# EAGLE design B210B (EAGLE 6.6.0)
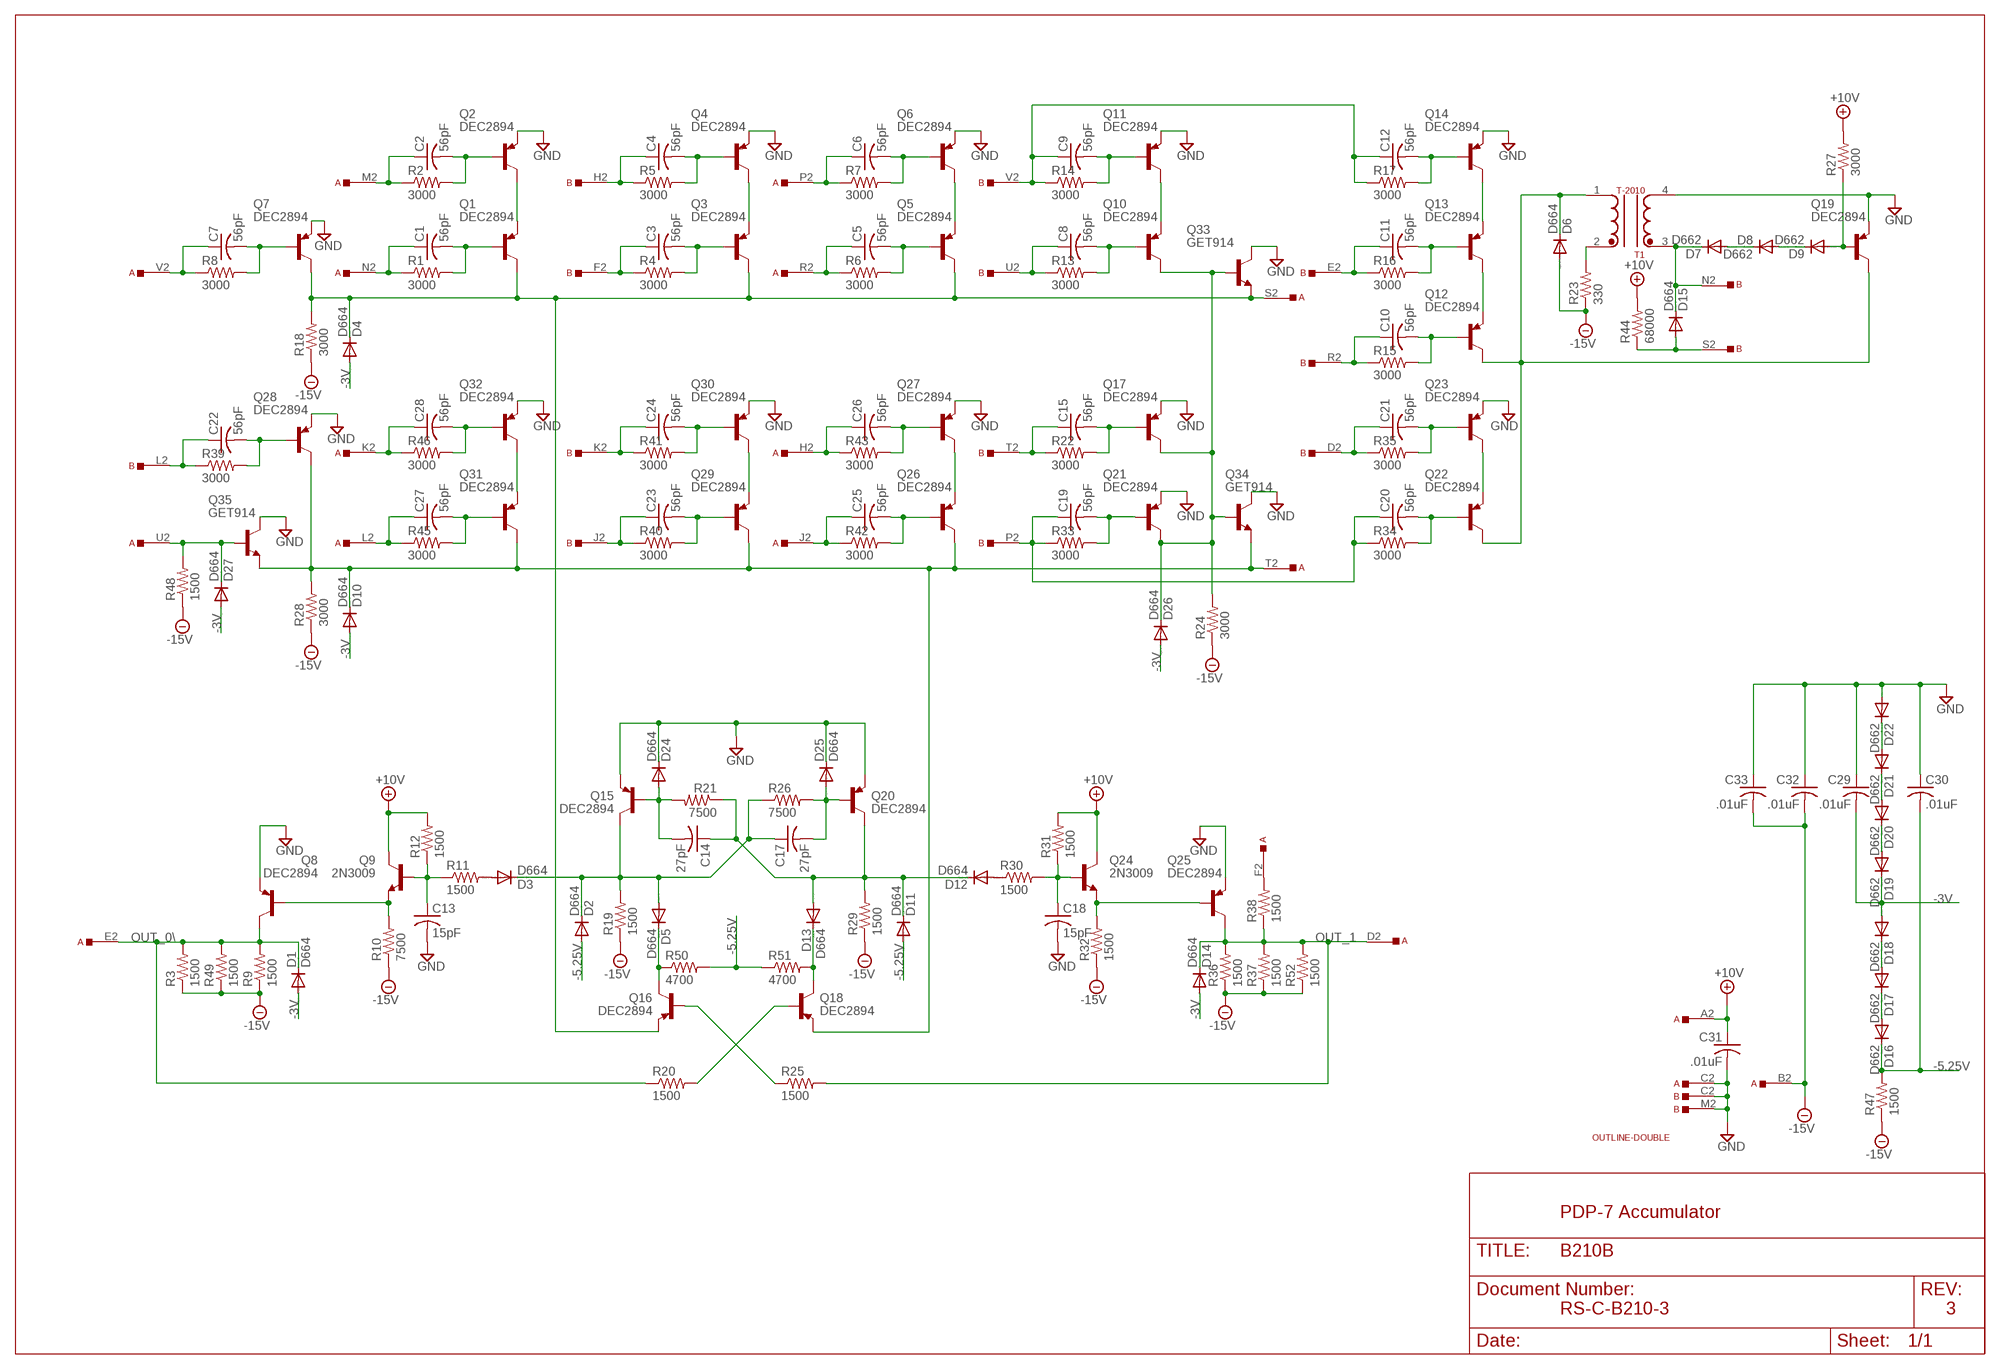
[diagram p0: schematic, sheet 1]

## Parts
A  SS-TOP  [EDGE-CON1]
B  SS-TOP  [EDGE-CON1]
C1  56pF  C-US  [C063-025X075]
C2  56pF  C-US  [C063-025X075]
C3  56pF  C-US  [C063-025X075]
C4  56pF  C-US  [C063-025X075]
C5  56pF  C-US  [C063-025X075]
C6  56pF  C-US  [C063-025X075]
C7  56pF  C-US  [C063-025X075]
C8  56pF  C-US  [C063-025X075]
C9  56pF  C-US  [C063-025X075]
C10  56pF  C-US  [C063-025X075]
C11  56pF  C-US  [C063-025X075]
C12  56pF  C-US  [C063-025X075]
C13  15pF  C-US  [C063-025X075]
C14  27pF  C-US  [C063-025X075]
C15  56pF  C-US  [C063-025X075]
C17  27pF  C-US  [C063-025X075]
C18  15pF  C-US  [C063-025X075]
C19  56pF  C-US  [C063-025X075]
C20  56pF  C-US  [C063-025X075]
C21  56pF  C-US  [C063-025X075]
C22  56pF  C-US  [C063-025X075]
C23  56pF  C-US  [C063-025X075]
C24  56pF  C-US  [C063-025X075]
C25  56pF  C-US  [C063-025X075]
C26  56pF  C-US  [C063-025X075]
C27  56pF  C-US  [C063-025X075]
C28  56pF  C-US  [C063-025X075]
C29  .01uF  C-US  [C063-025X075]
C30  .01uF  C-US  [C063-025X075]
C31  .01uF  C-US  [C063-025X075]
C32  .01uF  C-US  [C063-025X075]
C33  .01uF  C-US  [C063-025X075]
D1  D664  DIODE-DO35-10  [DO35-10]
D2  D664  DIODE-DO35-10  [DO35-10]
D3  D664  DIODE-DO35-10  [DO35-10]
D4  D664  DIODE-DO35-10  [DO35-10]
D5  D664  DIODE-DO35-10  [DO35-10]
D6  D664  DIODE-DO35-10  [DO35-10]
D7  D662  DIODE-DO35-10  [DO35-10]
D8  D662  DIODE-DO35-10  [DO35-10]
D9  D662  DIODE-DO35-10  [DO35-10]
D10  D664  DIODE-DO35-10  [DO35-10]
D11  D664  DIODE-DO35-10  [DO35-10]
D12  D664  DIODE-DO35-10  [DO35-10]
D13  D664  DIODE-DO35-10  [DO35-10]
D14  D664  DIODE-DO35-10  [DO35-10]
D15  D664  DIODE-DO35-10  [DO35-10]
D16  D662  DIODE-DO35-10  [DO35-10]
D17  D662  DIODE-DO35-10  [DO35-10]
D18  D662  DIODE-DO35-10  [DO35-10]
D19  D662  DIODE-DO35-10  [DO35-10]
D20  D662  DIODE-DO35-10  [DO35-10]
D21  D662  DIODE-DO35-10  [DO35-10]
D22  D662  DIODE-DO35-10  [DO35-10]
D24  D664  DIODE-DO35-10  [DO35-10]
D25  D664  DIODE-DO35-10  [DO35-10]
D26  D664  DIODE-DO35-10  [DO35-10]
D27  D664  DIODE-DO35-10  [DO35-10]
Q1  DEC2894  -PNP-TO5  [TO5]
Q2  DEC2894  -PNP-TO5  [TO5]
Q3  DEC2894  -PNP-TO5  [TO5]
Q4  DEC2894  -PNP-TO5  [TO5]
Q5  DEC2894  -PNP-TO5  [TO5]
Q6  DEC2894  -PNP-TO5  [TO5]
Q7  DEC2894  -PNP-TO5  [TO5]
Q8  DEC2894  -PNP-TO5  [TO5]
Q9  2N3009  -NPN-TO5  [TO5]
Q10  DEC2894  -PNP-TO5  [TO5]
Q11  DEC2894  -PNP-TO5  [TO5]
Q12  DEC2894  -PNP-TO5  [TO5]
Q13  DEC2894  -PNP-TO5  [TO5]
Q14  DEC2894  -PNP-TO5  [TO5]
Q15  DEC2894  -PNP-TO5  [TO5]
Q16  DEC2894  -PNP-TO5  [TO5]
Q17  DEC2894  -PNP-TO5  [TO5]
Q18  DEC2894  -PNP-TO5  [TO5]
Q19  DEC2894  -PNP-TO5  [TO5]
Q20  DEC2894  -PNP-TO5  [TO5]
Q21  DEC2894  -PNP-TO5  [TO5]
Q22  DEC2894  -PNP-TO5  [TO5]
Q23  DEC2894  -PNP-TO5  [TO5]
Q24  2N3009  -NPN-TO5  [TO5]
Q25  DEC2894  -PNP-TO5  [TO5]
Q26  DEC2894  -PNP-TO5  [TO5]
Q27  DEC2894  -PNP-TO5  [TO5]
Q28  DEC2894  -PNP-TO5  [TO5]
Q29  DEC2894  -PNP-TO5  [TO5]
Q30  DEC2894  -PNP-TO5  [TO5]
Q31  DEC2894  -PNP-TO5  [TO5]
Q32  DEC2894  -PNP-TO5  [TO5]
Q33  GET914  -NPN-TO5  [TO5]
Q34  GET914  -NPN-TO5  [TO5]
Q35  GET914  -NPN-TO5  [TO5]
R1  3000  R-US_0207/10  [0207/10]
R2  3000  R-US_0207/10  [0207/10]
R3  1500  R-US_0207/10  [0207/10]
R4  3000  R-US_0207/10  [0207/10]
R5  3000  R-US_0207/10  [0207/10]
R6  3000  R-US_0207/10  [0207/10]
R7  3000  R-US_0207/10  [0207/10]
R8  3000  R-US_0207/10  [0207/10]
R9  1500  R-US_0207/10  [0207/10]
R10  7500  R-US_0207/10  [0207/10]
R11  1500  R-US_0207/10  [0207/10]
R12  1500  R-US_0207/10  [0207/10]
R13  3000  R-US_0207/10  [0207/10]
R14  3000  R-US_0207/10  [0207/10]
R15  3000  R-US_0207/10  [0207/10]
R16  3000  R-US_0207/10  [0207/10]
R17  3000  R-US_0207/10  [0207/10]
R18  3000  R-US_0207/10  [0207/10]
R19  1500  R-US_0207/10  [0207/10]
R20  1500  R-US_0207/10  [0207/10]
R21  7500  R-US_0207/10  [0207/10]
R22  3000  R-US_0207/10  [0207/10]
R23  330  R-US_0207/10  [0207/10]
R24  3000  R-US_0207/10  [0207/10]
R25  1500  R-US_0207/10  [0207/10]
R26  7500  R-US_0207/10  [0207/10]
R27  3000  R-US_0207/10  [0207/10]
R28  3000  R-US_0207/10  [0207/10]
R29  1500  R-US_0207/10  [0207/10]
R30  1500  R-US_0207/10  [0207/10]
R31  1500  R-US_0207/10  [0207/10]
R32  1500  R-US_0207/10  [0207/10]
R33  3000  R-US_0207/10  [0207/10]
R34  3000  R-US_0207/10  [0207/10]
R35  3000  R-US_0207/10  [0207/10]
R36  1500  R-US_0207/10  [0207/10]
R37  1500  R-US_0207/10  [0207/10]
R38  1500  R-US_0207/10  [0207/10]
R39  3000  R-US_0207/10  [0207/10]
R40  3000  R-US_0207/10  [0207/10]
R41  3000  R-US_0207/10  [0207/10]
R42  3000  R-US_0207/10  [0207/10]
R43  3000  R-US_0207/10  [0207/10]
R44  68000  R-US_0207/10  [0207/10]
R45  3000  R-US_0207/10  [0207/10]
R46  3000  R-US_0207/10  [0207/10]
R47  1500  R-US_0207/10  [0207/10]
R48  1500  R-US_0207/10  [0207/10]
R49  1500  R-US_0207/10  [0207/10]
R50  4700  R-US_0207/10  [0207/10]
R51  4700  R-US_0207/10  [0207/10]
R52  1500  R-US_0207/10  [0207/10]
T1  T-2010  [TRANSFORMER2]
U$1  OUTLINE-DOUBLE  [DOUBLE]

## Nets
+10V: A.A2 C31.1 Q9.3(C) Q24.3(C) R12.2 R27.2 R31.2 R44.2
-3V: C29.2 D1.A D4.A D10.A D14.A D18.A D19.C D26.A D27.A
-5.25V: C30.2 D2.A D11.A D16.C R47.2 R50.2 R51.1
-15V: A.B2 C32.2 C33.2 D6.A R3.1 R9.1 R10.1 R18.1 R19.1 R23.1 R24.1 R28.1 R29.1 R32.1 R36.1 R37.1 R47.1 R48.1 R49.1 R52.1
GND: A.C2 B.C2 B.M2 C13.2 C18.2 C29.1 C30.1 C31.2 C32.1 C33.1 D22.A D24.C D25.C Q2.1(E) Q4.1(E) Q6.1(E) Q7.1(E) Q8.1(E) Q11.1(E) Q14.1(E) Q15.1(E) Q17.1(E) Q19.1(E) Q20.1(E) Q21.1(E) Q23.1(E) Q25.1(E) Q27.1(E) Q28.1(E) Q30.1(E) Q32.1(E) Q33.3(C) Q34.3(C) Q35.3(C) T1.4
N$1: A.N2 C1.1 R1.1
N$2: C1.2 Q1.2(B) R1.2
N$3: A.M2 C2.1 R2.1
N$4: C2.2 Q2.2(B) R2.2
N$5: B.F2 C3.1 R4.1
N$6: C3.2 Q3.2(B) R4.2
N$7: B.H2 C4.1 R5.1
N$8: C4.2 Q4.2(B) R5.2
N$9: A.R2 C5.1 R6.1
N$10: C5.2 Q5.2(B) R6.2
N$11: A.P2 C6.1 R7.1
N$12: C6.2 Q6.2(B) R7.2
N$13: A.V2 C7.1 R8.1
N$14: C7.2 Q7.2(B) R8.2
N$15: D6.C Q12.3(C) Q19.3(C) Q22.3(C) T1.1
N$16: R23.2 T1.2
N$17: Q10.1(E) Q11.3(C)
N$18: D26.C Q10.3(C) Q17.3(C) Q21.3(C) Q33.2(B) Q34.2(B) R24.2
N$19: B.U2 C8.1 R13.1
N$20: C8.2 Q10.2(B) R13.2
N$21: B.V2 C9.1 C12.1 R14.1 R17.1
N$22: C9.2 Q11.2(B) R14.2
N$23: B.R2 C10.1 R15.1
N$24: C10.2 Q12.2(B) R15.2
N$25: B.E2 C11.1 R16.1
N$26: C11.2 Q13.2(B) R16.2
N$27: B.N2 D7.C D15.C T1.3
N$28: C12.2 Q14.2(B) R17.2
N$29: B.T2 C15.1 R22.1
N$30: C15.2 Q17.2(B) R22.2
N$31: C17.1 D2.C D3.C D5.A Q15.3(C) R19.2 R26.1
N$32: C17.2 D25.A Q20.2(B) R26.2
N$33: Q16.2(B) R25.1
N$34: Q18.2(B) R20.2
N$35: C14.1 D11.C D12.C D13.A Q20.3(C) R21.1 R29.2
N$36: C14.2 D24.A Q15.2(B) R21.2
N$37: B.P2 C19.1 C20.1 R33.1 R34.1
N$38: C19.2 Q21.2(B) R33.2
N$39: D7.A D8.C
N$40: D8.A D9.C
N$41: D9.A Q19.2(B) R27.1
N$42: D21.A D22.C
N$43: B.L2 C22.1 R39.1
N$44: C22.2 Q28.2(B) R39.2
N$45: A.T2 D10.C Q18.1(E) Q26.3(C) Q28.3(C) Q29.3(C) Q31.3(C) Q34.1(E) Q35.1(E) R28.2
N$46: D5.C Q16.3(C) R50.1
N$47: B.S2 D15.A R44.1
N$48: C25.2 Q26.2(B) R42.2
N$49: Q1.1(E) Q2.3(C)
N$50: A.S2 D4.C Q1.3(C) Q3.3(C) Q5.3(C) Q7.3(C) Q16.1(E) Q33.1(E) R18.2
N$51: Q5.1(E) Q6.3(C)
N$52: Q3.1(E) Q4.3(C)
N$53: Q12.1(E) Q13.3(C)
N$54: Q13.1(E) Q14.3(C)
N$55: A.L2 C27.1 R45.1
N$56: C27.2 Q31.2(B) R45.2
N$57: A.K2 C28.1 R46.1
N$58: C28.2 Q32.2(B) R46.2
N$59: C20.2 Q22.2(B) R34.2
N$60: Q31.1(E) Q32.3(C)
N$61: A.H2 C26.1 R43.1
N$62: C26.2 Q27.2(B) R43.2
N$63: C23.2 Q29.2(B) R40.2
N$64: Q26.1(E) Q27.3(C)
N$65: A.J2 C25.1 R42.1
N$66: B.K2 C24.1 R41.1
N$67: C24.2 Q30.2(B) R41.2
N$68: B.D2 C21.1 R35.1
N$69: Q29.1(E) Q30.3(C)
N$70: B.J2 C23.1 R40.1
N$71: C21.2 Q23.2(B) R35.2
N$72: Q22.1(E) Q23.3(C)
N$73: D20.A D21.C
N$74: D19.A D20.C
N$75: D16.A D17.C
N$76: D17.A D18.C
N$77: D13.C Q18.3(C) R51.2
N$78: D3.A R11.2
N$79: C13.1 Q9.2(B) R11.1 R12.1
N$80: C18.1 Q24.2(B) R30.2 R31.1
N$81: D12.A R30.1
N$82: Q8.2(B) Q9.1(E) R10.2
N$83: Q24.1(E) Q25.2(B) R32.2
N$84: A.F2 R38.2
N$85: A.U2 D27.C Q35.2(B) R48.2
OUT_0\: A.E2 D1.C Q8.3(C) R3.2 R9.2 R20.1 R49.2
OUT_1: A.D2 D14.C Q25.3(C) R25.2 R36.2 R37.2 R38.1 R52.2
Unconnected: B.A2 B.B2

## Notes on the sheet
- PDP-7 Accumulator
- RS-C-B210-3 | 3

## Library data of the parts
A B = dec-con:SS-TOP: Single Sided Top Connector. Also suitable for building wider single-sided modules.
C1-C15 C17-C33 = dec-con:C-US: Capacitors with funky DEC lead spacing.
D1-D22 D24-D27 = diode:DIODE-: DIODE
Q1-Q8 Q10-Q23 Q25-Q32 = transistor:*-PNP-: PNP Transistror
Q9 Q24 Q33-Q35 = transistor:*-NPN-: NPN Transistror BF959 corrected 2008.03.06
R1-R52 = rcl:R-US_: RESISTOR, American symbol
T1 = dec-con:T-2010: Button Transformer
U$1 = dec-con:OUTLINE-*: Board outlines for DEC boards.

## Board
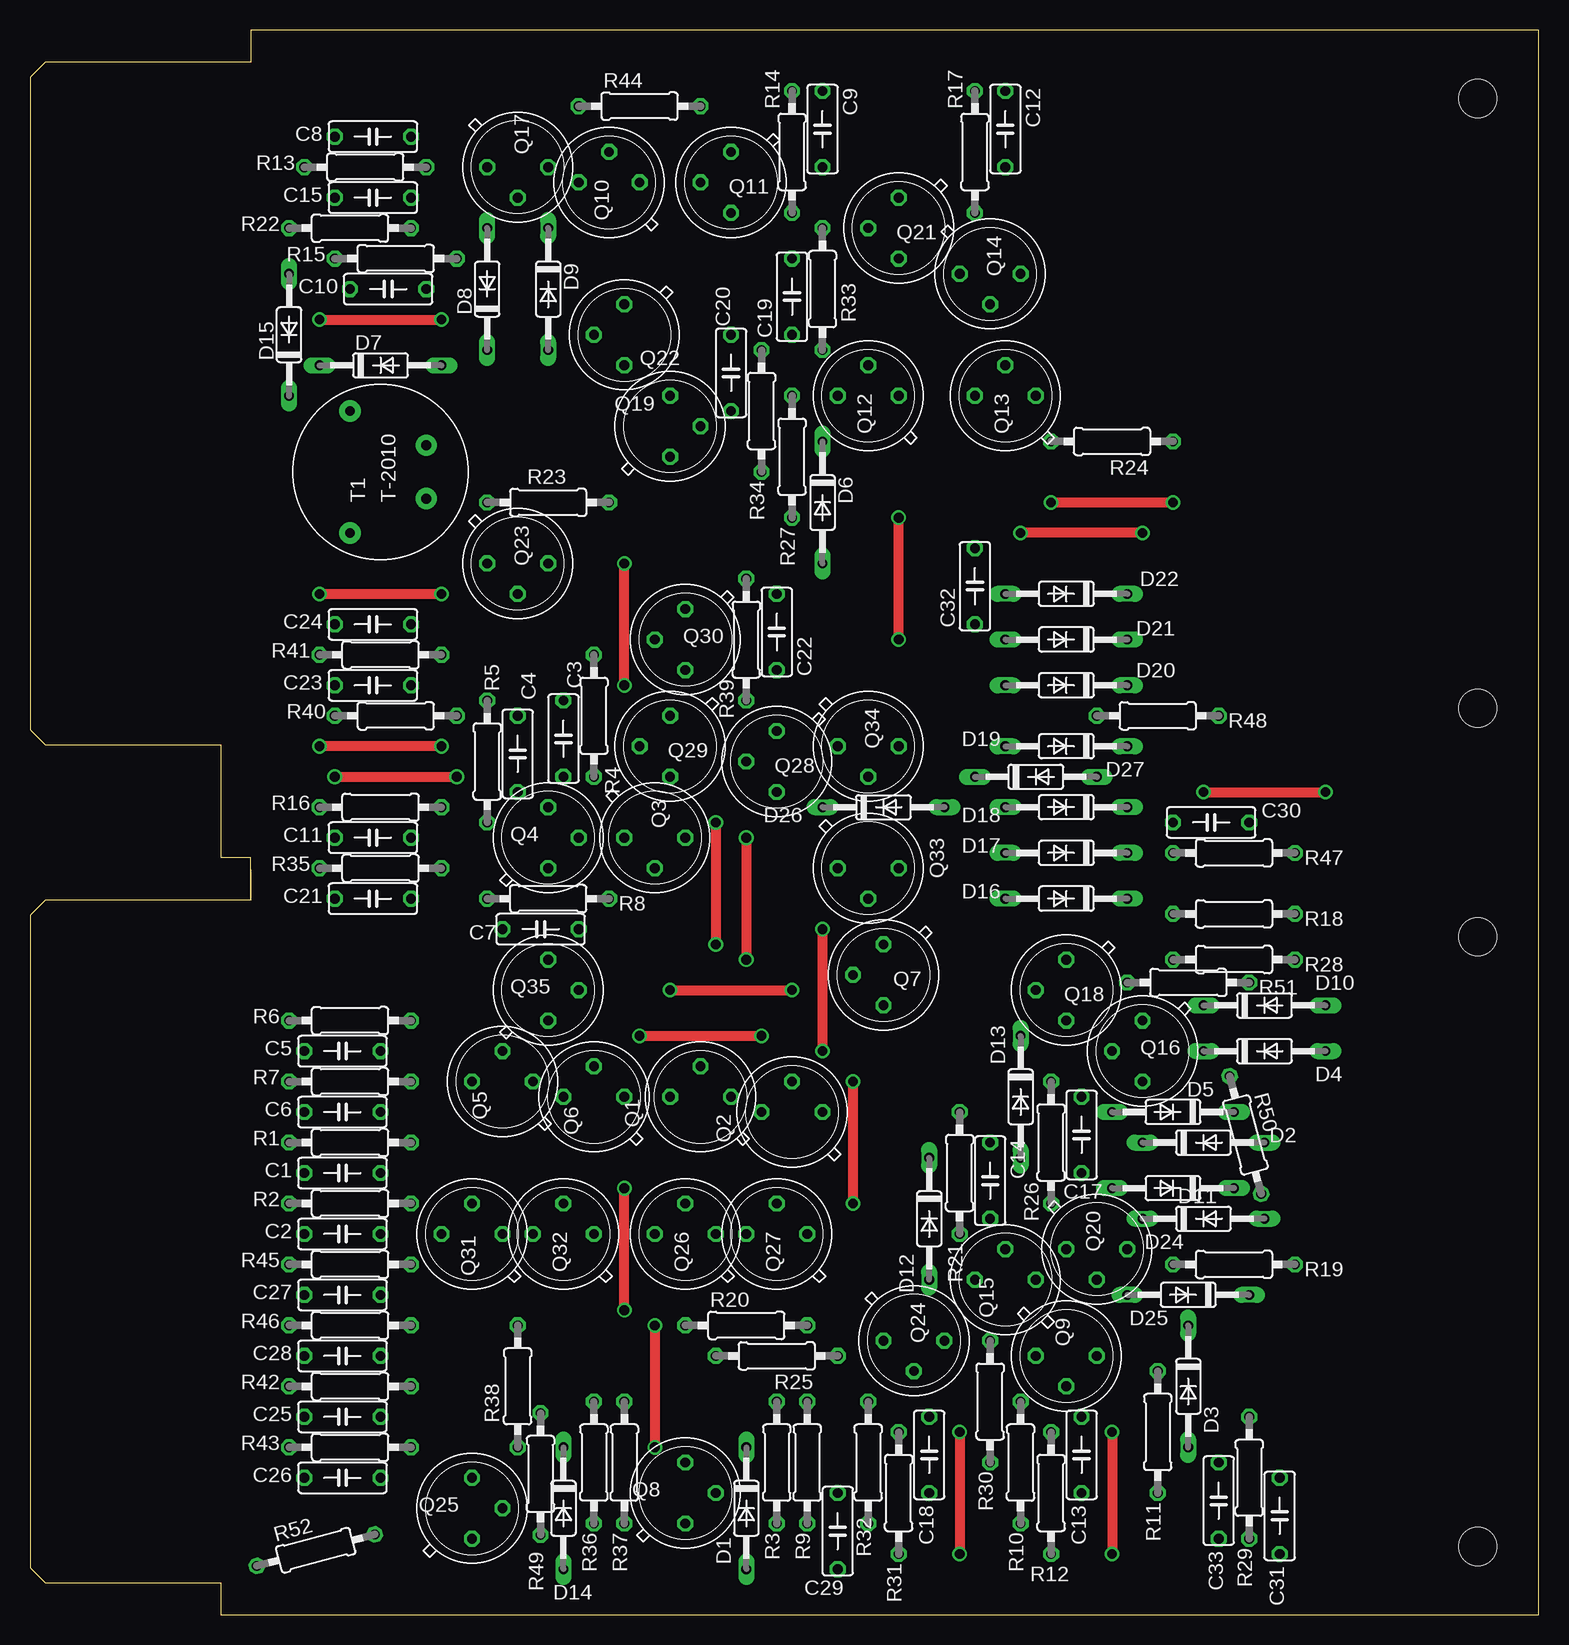
[diagram p1: board, top side]
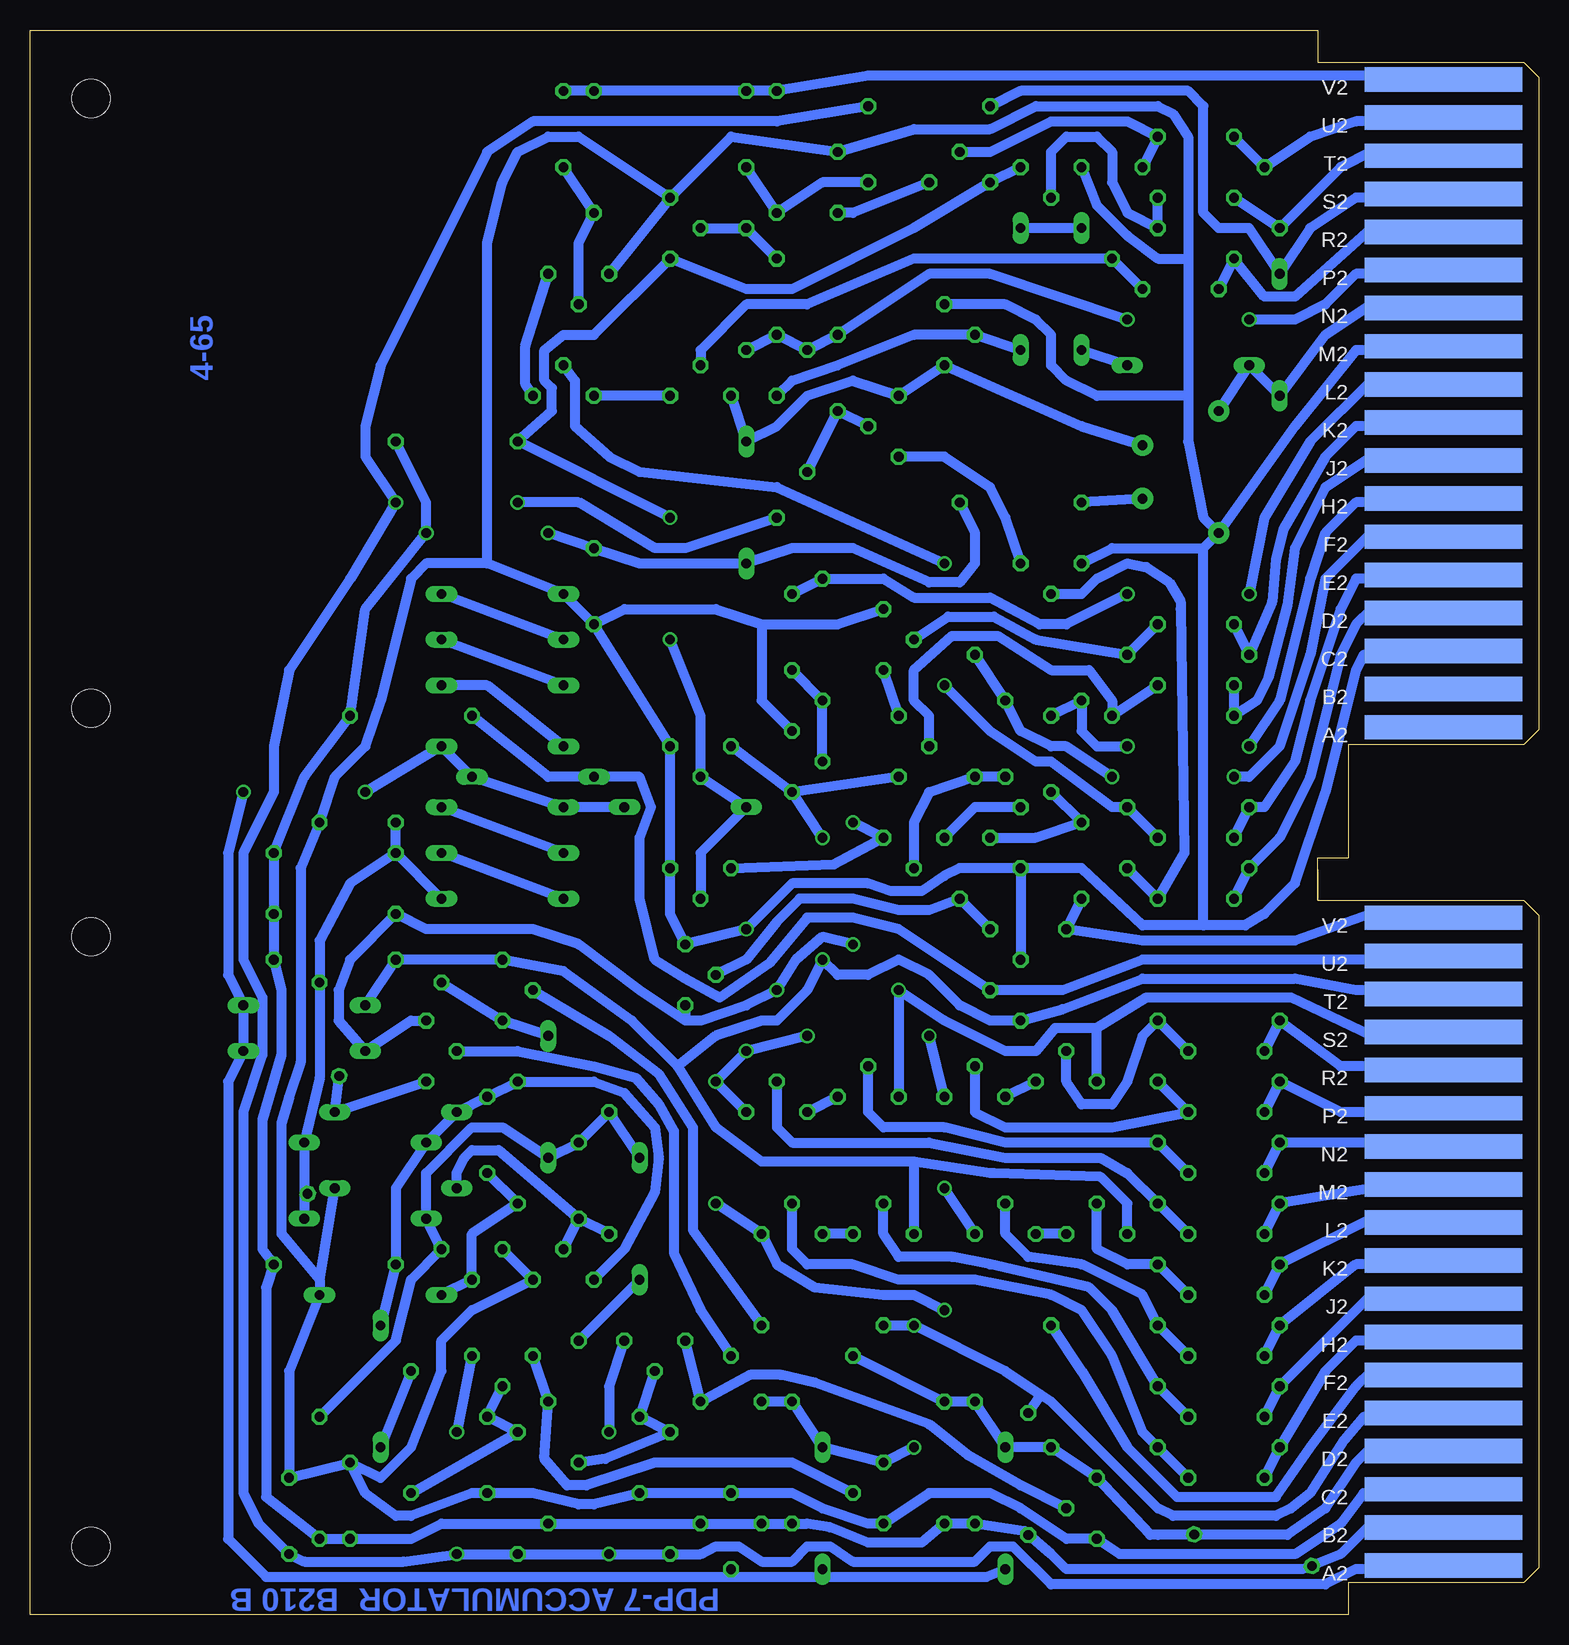
[diagram p2: board, bottom side, seen from below]

Size 125.73 x 132.08 mm. Coordinates in mm from the lower left corner, seen from the top.
Copper layers (1+16): Top 0.035mm / dielectric 1.5mm / Bottom 0.035mm
Design rules "16mils": minimum track width 16mil, minimum drill 32mil, track to track 15mil, track to pad 10mil, pad to pad 10mil, via to via 10mil, smd to smd 10mil, copper to edge 13mil, drill to drill 10mil, minimum pad ring 10mil, minimum via ring 8mil, stop-mask expansion 0mil, vias tented up to drill 0mil, thermal gap 10mil

### Footprints (pad centres in the part's own frame; a part is rotated, then mirrored left to right if it is on the bottom)
EDGE-CON1 = smd 13.106 x 2.032 bottom: A2 7.938,4.128; B2 7.938,7.303; C2 7.938,10.477; D2 7.938,13.652; E2 7.938,16.828; F2 7.938,20.003; H2 7.938,23.177; J2 7.938,26.352; K2 7.938,29.527; L2 7.938,32.703; M2 7.938,35.877; N2 7.938,39.053; P2 7.938,42.227; R2 7.938,45.403; S2 7.938,48.578; T2 7.938,51.752; U2 7.938,54.928; V2 7.938,58.102
C063-025X075 = drill 0.813 octagon: 1 -2.54,0; 2 3.81,0
DO35-10 = drill 0.813 long: A 5.08,0; C -5.08,0
TO5 = drill 0.813 octagon: 1 0,-2.54; 2 2.54,0; 3 0,2.54
0207/10 = drill 0.813 octagon: 1 -5.08,0; 2 5.08,0
TRANSFORMER2 = drill 0.813 pad 1.778: 1 2.223,-3.81; 2 -2.223,-3.81; 3 5.08,2.54; 4 -5.08,2.54
DOUBLE = hole 3.175: 120.65,56.515; 120.65,5.715; 120.65,75.565; 120.65,126.365

### Placement (x,y rotation side)
A  0,0 0 top
B  0,69.85 0 top
C1  25.4,36.83 0 top
C2  25.4,31.75 0 top
C3  44.45,73.66 270 top
C4  40.64,72.39 270 top
C5  25.4,46.99 0 top
C6  25.4,41.91 0 top
C7  41.91,57.15 0 top
C8  27.94,123.19 0 top
C9  66.04,124.46 270 top
C10  29.21,110.49 0 top
C11  27.94,64.77 0 top
C12  81.28,124.46 270 top
C13  87.63,13.97 270 top
C14  80.01,36.83 270 top
C15  27.94,118.11 0 top
C17  87.63,40.64 270 top
C18  74.93,13.97 270 top
C19  63.5,109.22 90 top
C20  58.42,104.14 270 top
C21  27.94,59.69 0 top
C22  62.23,82.55 270 top
C23  27.94,77.47 0 top
C24  27.94,82.55 0 top
C25  25.4,16.51 0 top
C26  25.4,11.43 0 top
C27  25.4,26.67 0 top
C28  25.4,21.59 0 top
C29  67.31,7.62 270 top
C30  99.06,66.04 180 top
C31  104.14,7.62 90 top
C32  78.74,85.09 90 top
C33  99.06,10.16 270 top
D1  59.69,8.89 270 top
D2  97.79,39.37 0 top
D3  96.52,19.05 270 top
D4  102.87,46.99 0 top
D5  95.25,41.91 180 top
D6  66.04,92.71 270 top
D7  29.21,104.14 0 top
D8  38.1,110.49 90 top
D9  43.18,110.49 270 top
D10  102.87,50.8 0 top
D11  97.79,33.02 0 top
D12  74.93,33.02 270 top
D13  82.55,43.18 270 top
D14  44.45,8.89 270 top
D15  21.59,106.68 90 top
D16  86.36,59.69 180 top
D17  86.36,63.5 180 top
D18  86.36,67.31 180 top
D19  86.36,72.39 180 top
D20  86.36,77.47 180 top
D21  86.36,81.28 180 top
D22  86.36,85.09 180 top
D24  95.25,35.56 180 top
D25  96.52,26.67 180 top
D26  71.12,67.31 0 top
D27  83.82,69.85 0 top
Q1  55.88,43.18 90 top
Q2  63.5,41.91 90 top
Q3  52.07,64.77 270 top
Q4  43.18,64.77 0 top
Q5  39.37,44.45 90 top
Q6  46.99,43.18 90 top
Q7  71.12,53.34 180 top
Q8  54.61,10.16 0 top
Q9  86.36,21.59 270 top
Q10  48.26,119.38 90 top
Q11  58.42,119.38 180 top
Q12  69.85,101.6 90 top
Q13  81.28,101.6 90 top
Q14  80.01,111.76 270 top
Q15  81.28,27.94 90 top
Q16  92.71,46.99 180 top
Q17  40.64,120.65 270 top
Q18  86.36,52.07 180 top
Q19  49.53,106.68 180 top
Q20  88.9,30.48 270 top
Q21  72.39,115.57 180 top
Q22  53.34,99.06 0 top
Q23  40.64,87.63 270 top
Q24  73.66,22.86 270 top
Q25  36.83,8.89 0 top
Q26  54.61,31.75 90 top
Q27  62.23,31.75 90 top
Q28  62.23,71.12 180 top
Q29  53.34,72.39 180 top
Q30  54.61,81.28 180 top
Q31  36.83,31.75 90 top
Q32  44.45,31.75 90 top
Q33  69.85,62.23 270 top
Q34  69.85,72.39 270 top
Q35  43.18,52.07 0 top
R1  26.67,39.37 0 top
R2  26.67,34.29 0 top
R3  62.23,12.7 90 top
R4  46.99,74.93 270 top
R5  38.1,71.12 270 top
R6  26.67,49.53 0 top
R7  26.67,44.45 0 top
R8  43.18,59.69 0 top
R9  64.77,12.7 90 top
R10  82.55,12.7 90 top
R11  93.98,15.24 90 top
R12  85.09,10.16 270 top
R13  27.94,120.65 0 top
R14  63.5,121.92 270 top
R15  30.48,113.03 0 top
R16  29.21,67.31 0 top
R17  78.74,121.92 270 top
R18  100.33,58.42 180 top
R19  100.33,29.21 180 top
R20  59.69,24.13 0 top
R21  77.47,36.83 270 top
R22  26.67,115.57 0 top
R23  43.18,92.71 180 top
R24  90.17,97.79 180 top
R25  62.23,21.59 180 top
R26  85.09,39.37 270 top
R27  63.5,96.52 270 top
R28  100.33,54.61 180 top
R29  101.6,11.43 90 top
R30  80.01,17.78 270 top
R31  72.39,10.16 270 top
R32  69.85,12.7 90 top
R33  66.04,110.49 90 top
R34  60.96,100.33 270 top
R35  29.21,62.23 0 top
R36  46.99,12.7 90 top
R37  49.53,12.7 90 top
R38  40.64,19.05 90 top
R39  59.69,81.28 270 top
R40  30.48,74.93 0 top
R41  29.21,80.01 0 top
R42  26.67,19.05 0 top
R43  26.67,13.97 0 top
R44  50.8,125.73 0 top
R45  26.67,29.21 0 top
R46  26.67,24.13 0 top
R47  100.33,63.5 180 top
R48  93.98,74.93 180 top
R49  42.55,11.75 90 top
R50  101.28,40.01 285 top
R51  96.52,52.7 180 top
R52  23.81,5.4 15 top
T1  29.21,95.25 90 top
U$1  0,0 0 top

### Tracks (layer width: path | path; a pad name or v marks a point on that pad's centre or on a via)
+10V  (via drill 0.81)
  Top 0.813: v85.09,92.71 v95.25,92.71 | v77.47,15.24 v77.47,5.08 | v90.17,15.24 v90.17,5.08
  Bottom 0.813: A.A2 8.89,3.81 15.24,3.81 17.78,2.54 40.64,2.54 43.82,5.71 45.72,5.71 46.99,4.45 57.15,4.45 59.06,5.71 60.96,5.71 62.23,4.45 64.77,4.45 66.68,5.71 68.58,5.71 69.85,5.08 R31.2 v77.47,5.08 R12.2 v90.17,5.08 94.62,4.45 102.87,4.45 C31.1 106.68,7.62 107.95,10.16 107.95,41.91 106.36,46.67 106.36,51.44 107.95,54.61 107.95,63.5 105.41,68.58 105.41,72.39 104.14,78.74 99.06,86.36 v95.25,92.71 97.79,96.52 97.79,99.06 96.52,104.14 87.63,121.92 83.82,124.46 63.5,124.46 R44.2 | R27.2 71.12,88.9 73.66,88.9 80.01,92.71 v85.09,92.71 | Q24.3 77.47,19.05 v77.47,15.24 | Q9.3 v90.17,15.24
-3V  (via drill 0.81)
  Top 0.813: v97.79,68.58 v107.95,68.58
  Bottom 0.813: v97.79,68.58 D19.C D27.A D18.A D26.A | v107.95,68.58 109.22,63.5 109.22,53.34 D10.A D4.A 109.22,44.45 109.22,6.35 106.05,3.17 67.31,3.17 | 67.31,3.17 59.69,3.17 | 59.69,3.17 46.04,3.17 D14.A | C29.2 67.31,3.17 | D1.A 59.69,3.17
-5.25V
  Bottom 0.813: D16.C R47.2 | R47.2 C30.2 | R47.2 99.06,60.96 101.6,56.2 R51.1 101.6,44.77 D2.A 102.87,35.56 | 102.87,35.56 D11.A | R50.2 102.87,35.56
-15V  (via drill 0.81)
  Top 0.813: v92.71,90.17 v82.55,90.17
  Bottom 0.813: A.B2 8.89,7.62 13.97,7.62 16.51,5.08 19.14,4.03 | 19.14,4.03 19.69,3.81 39.37,3.81 40.64,5.08 42.73,6.87 | R23.1 46.99,90.17 46.99,87.63 48.26,86.04 50.8,86.04 57.15,88.9 62.23,88.9 D6.A 74.93,87.63 C32.2 v82.55,90.17 | R24.1 92.71,92.71 v92.71,90.17 97.79,83.82 R48.1 102.87,69.85 R47.1 R18.1 R28.1 104.78,52.07 104.78,46.67 106.36,41.27 106.36,30.48 R19.1 106.05,27.3 106.05,9.84 R29.1 C33.2 93.98,6.35 91.44,7.62 R10.1 R32.1 R9.1 R3.1 60.96,7.62 59.06,7.3 55.88,6.03 51.44,6.03 R37.1 R36.1 42.86,6.99 42.73,6.87 | R52.1 19.14,4.03 | R49.1 42.73,6.87
GND  (via drill 0.81)
  Top 0.813: v68.58,44.45 v68.58,34.29 | v66.04,57.15 v66.04,46.99 | v50.8,48.26 v60.96,48.26 | v49.53,25.4 v49.53,35.56
  Bottom 0.813: B.M2 8.89,105.41 15.24,105.41 20.32,99.06 T1.4 | B.C2 8.89,80.01 14.61,80.01 15.24,78.74 17.78,68.58 20.32,60.96 22.86,58.42 24.45,57.47 27.94,57.47 | 27.94,57.47 27.94,88.9 | 27.94,88.9 T1.4 | 27.94,57.47 33.02,57.47 38.1,62.23 Q4.1 | Q4.1 Q35.3 | Q4.1 48.26,62.23 49.53,61.59 51.44,60.33 53.98,60.33 55.88,60.96 62.23,60.96 v66.04,57.15 Q7.1 72.39,58.42 Q33.3 Q34.3 C32.1 | C32.1 76.2,83.82 68.58,83.82 64.77,82.55 | 64.77,82.55 64.77,76.2 Q28.1 | 64.77,82.55 58.42,82.55 Q30.1 | C32.1 D22.A 87.63,87.63 | 87.63,87.63 87.63,114.3 86.36,119.38 85.09,121.92 82.55,123.19 80.01,123.19 Q21.1 | Q21.1 Q14.1 | Q21.1 67.31,123.19 Q11.1 52.07,123.83 45.72,123.83 41.91,125.73 31.75,125.73 30.48,125.09 29.21,123.19 29.21,113.03 | 29.21,113.03 29.21,101.6 | 29.21,101.6 29.21,97.79 27.94,91.44 T1.4 | 29.21,101.6 36.83,101.6 39.37,102.87 40.64,104.14 40.64,106.68 41.91,107.95 44.45,109.22 Q19.1 | Q17.1 36.83,117.47 34.29,114.94 31.75,113.03 29.21,113.03 | 87.63,87.63 92.71,87.63 93.98,86.36 96.52,76.2 97.79,72.39 100.33,69.85 C30.1 103.19,62.23 103.19,46.04 104.14,43.18 104.78,40.96 104.78,31.75 101.6,27.94 | 101.6,27.94 D24.C | 101.6,27.94 D25.C 104.14,20.32 C31.2 C33.1 | C33.1 96.52,11.43 93.98,13.97 91.44,20.32 91.44,22.86 88.9,25.4 Q15.1 Q20.1 | A.C2 8.89,10.16 14.61,10.16 16.51,7.62 20.32,5.08 34.93,5.08 Q25.1 39.37,6.35 43.18,8.89 45.72,10.16 50.8,10.16 Q8.1 55.88,7.62 59.69,8.89 62.23,10.16 C29.1 C18.2 78.74,9.21 80.01,9.21 83.82,10.16 C13.2 88.9,10.16 93.98,8.26 95.25,8.26 97.79,10.16 C33.1 | Q2.1 v68.58,44.45 v66.04,46.99 v60.96,48.26 | v68.58,34.29 Q27.1 63.5,29.21 60.33,27.3 54.61,26.67 52.07,26.67 v49.53,25.4
  Bottom 0.813: Q6.1 v50.8,48.26 | v49.53,35.56 Q32.1 | Q23.1 35.56,88.9 27.94,88.9
N$1
  Bottom 0.813: A.N2 7.62,39.37 R1.1 C1.1
N$2
  Bottom 0.813: C1.2 R1.2 44.45,39.37 49.53,40.64 54.61,40.64 55.88,41.91 Q1.2
N$3
  Bottom 0.813: A.M2 8.89,35.56 13.97,35.56 R2.1 C2.1
N$4
  Bottom 0.813: C2.2 R2.2 34.29,36.83 36.51,38.1 44.45,38.1 50.8,39.37 62.23,39.37 63.5,40.64 Q2.2
N$5  (via drill 0.81)
  Top 0.813: v25.4,69.85 v35.56,69.85
  Bottom 0.813: B.F2 8.89,90.17 13.97,90.17 17.78,86.36 19.05,80.01 21.59,72.39 24.13,69.85 v25.4,69.85 | v35.56,69.85 39.37,72.39 40.64,72.39 43.18,73.66 C3.1 R4.1
N$6
  Bottom 0.813: C3.2 R4.2 50.8,68.58 52.07,66.04 Q3.2
N$7  (via drill 0.81)
  Top 0.813: v34.29,72.39 v24.13,72.39
  Bottom 0.813: C4.1 R5.1 38.1,73.66 36.83,72.39 v34.29,72.39 | B.H2 8.89,92.71 15.24,92.71 17.78,90.17 19.05,86.36 21.59,76.2 v24.13,72.39
N$8
  Bottom 0.813: C4.2 R5.2 41.91,64.77 Q4.2
N$9
  Bottom 0.813: C5.1 R6.1 16.51,45.72 8.89,45.72 A.R2
N$10
  Bottom 0.813: C5.2 R6.2 33.02,48.26 34.29,44.45 35.56,42.55 38.1,42.55 39.37,44.45 Q5.2
N$11
  Bottom 0.813: C6.1 R7.1 16.51,41.91 8.89,41.91 A.P2
N$12
  Bottom 0.813: R7.2 C6.2 35.56,40.64 44.45,40.64 46.99,41.91 Q6.2
N$13
  Bottom 0.813: R8.1 C7.1 33.02,56.2 20.32,56.2 13.97,58.42 8.89,58.42 A.V2
N$14
  Bottom 0.813: C7.2 R8.2 50.8,58.74 53.34,58.74 57.15,59.69 61.6,59.69 63.5,57.78 66.04,54.61 Q7.2
N$15
  Bottom 0.813: Q12.3 D6.C 63.5,99.06 60.96,101.6 57.15,102.87 Q22.3 Q19.3 38.1,99.06 T1.1
N$16
  Bottom 0.813: T1.2 R23.2
N$17
  Bottom 0.813: Q10.1 57.15,116.84 Q11.3
N$18  (via drill 0.81)
  Top 0.813: v72.39,81.28 v72.39,91.44
  Bottom 0.813: Q17.3 Q10.3 52.07,115.57 62.23,110.49 66.04,110.49 Q21.3 78.74,106.68 81.28,106.68 82.87,105.41 82.87,102.87 82.23,102.23 82.23,100.33 R24.2 v72.39,91.44 | v72.39,81.28 69.85,74.93 Q34.2 D26.C 69.85,63.5 Q33.2
N$19
  Bottom 0.813: B.U2 10.16,124.46 15.24,124.46 19.05,123.19 R13.1 C8.1
N$20
  Bottom 0.813: R13.2 C8.2 34.29,124.46 40.64,124.46 45.72,121.92 Q10.2
N$21
  Bottom 0.813: B.V2 8.89,128.27 55.88,128.27 R14.1 | R14.1 R17.1 C12.1 C9.1 R14.1
N$22
  Bottom 0.813: C9.2 R14.2 59.69,119.38 Q11.2
N$23
  Bottom 0.813: C10.1 R15.1 22.86,109.86 20.32,109.86 13.97,115.57 8.89,115.57 B.R2
N$24
  Bottom 0.813: C10.2 R15.2 52.07,113.03 60.96,109.22 66.04,109.22 69.85,105.41 Q12.2
N$25
  Bottom 0.813: B.E2 8.89,86.36 15.24,86.36 16.51,83.82 19.05,76.2 20.32,71.12 22.86,67.31 R16.1 C11.1
N$26  (via drill 0.81)
  Top 0.813: v49.53,77.47 v49.53,87.63
  Bottom 0.813: C11.2 R16.2 35.56,67.31 40.64,71.12 41.91,71.12 45.72,73.66 v49.53,77.47 | Q13.2 80.33,102.87 80.33,99.06 77.47,96.52 74.93,95.25 63.5,93.98 v49.53,87.63
N$27
  Bottom 0.813: B.N2 8.89,109.22 13.97,109.22 17.78,106.68 D15.C D7.C T1.3
N$28
  Bottom 0.813: Q14.2 80.01,114.3 R17.2 C12.2
N$29
  Bottom 0.813: B.T2 8.89,121.92 13.97,121.92 16.51,120.65 R22.1 C15.1
N$30
  Bottom 0.813: C15.2 R22.2 34.29,116.84 35.56,119.38 35.56,121.92 36.83,123.19 39.37,123.19 40.64,121.92 Q17.2
N$31
  Bottom 0.813: Q15.3 76.2,30.48 73.66,35.24 73.34,38.1 73.66,40.64 76.2,43.5 78.74,44.45 R26.1 C17.1 D5.A D2.C 95.25,35.56 R19.2 D3.C
N$32
  Bottom 0.813: C17.2 R26.2 88.9,31.75 Q20.2 D25.A
N$33
  Bottom 0.813: Q16.2 85.09,46.99 78.74,45.72 75.25,44.77 73.34,42.55 72.07,40.32 72.07,30.16 69.85,25.4 R25.1
N$34
  Bottom 0.813: Q18.2 77.47,48.26 73.34,45.09 70.49,40.64 70.49,32.07 R20.2
N$35
  Bottom 0.813: R29.2 95.25,22.86 93.98,27.94 Q20.3 D11.C 92.71,36.83 88.9,40.64 86.36,40.64 D13.A C14.1 R21.1 D12.C
N$36
  Bottom 0.813: R21.2 C14.2 | Q15.2 C14.2 | D24.A 90.17,36.83 89.54,38.1 88.9,38.73 86.68,38.73 C14.2
N$37  (via drill 0.81)
  Top 0.813: v24.13,107.95 v34.29,107.95
  Bottom 0.813: B.P2 8.89,111.76 15.24,111.76 17.78,109.22 20.32,107.95 v24.13,107.95 | v34.29,107.95 45.72,111.76 50.8,111.76 C20.1 R34.1 C19.1 R33.1
N$38
  Bottom 0.813: C19.2 R33.2 Q21.2
N$39
  Bottom 0.813: D7.A D8.C
N$40
  Bottom 0.813: D8.A D9.C
N$41
  Bottom 0.813: D9.A Q19.2 52.07,106.68 58.42,104.14 62.23,102.87 R27.1
N$42
  Bottom 0.813: D21.A D22.C
N$43  (via drill 0.81)
  Top 0.813: v24.13,85.09 v34.29,85.09
  Bottom 0.813: B.L2 8.89,102.87 13.97,102.87 19.05,97.79 22.86,91.44 v24.13,85.09 | v34.29,85.09 39.37,82.55 41.59,82.55 45.72,84.77 52.07,84.77 54.61,86.36 R39.1 C22.1
N$44
  Bottom 0.813: Q28.2 R39.2 C22.2
N$45  (via drill 0.81)
  Top 0.813: v59.69,64.77 v59.69,54.61
  Bottom 0.813: Q31.3 34.29,34.29 36.51,36.51 45.4,36.83 45.72,36.83 52.07,37.78 | 52.07,37.78 Q26.3 | 52.07,37.78 64.77,37.78 68.58,40.64 71.76,45.72 | Q29.3 Q28.3 | Q28.3 v59.69,64.77 | 71.76,45.72 68.58,48.26 64.77,49.53 63.5,49.53 60.96,52.07 v59.69,54.61 58.42,53.34 55.88,53.34 53.34,54.61 50.8,53.34 48.26,50.8 45.72,49.53 Q35.1 39.69,50.48 33.02,53.02 20.32,53.02 15.24,52.07 8.89,52.07 A.T2 | Q28.3 Q34.1 | 71.76,45.72 75.57,49.53 81.28,53.66 Q18.1 R28.2 D10.C
N$46
  Bottom 0.813: Q16.3 D5.C R50.1
N$47
  Bottom 0.813: B.S2 7.62,118.11 15.24,118.11 19.05,115.57 D15.A 24.13,115.57 26.67,115.57 27.94,116.84 27.94,125.73 29.21,127 43.18,127 R44.1
N$48
  Bottom 0.813: C25.2 R42.2 35.56,25.4 37.47,27.3 45.72,29.21 48.9,29.84 53.34,29.84 54.61,31.75 Q26.2
N$49
  Bottom 0.813: Q1.1 Q2.3
N$50  (via drill 0.81)
  Top 0.813: v53.34,52.07 v63.5,52.07 | v57.15,66.04 v57.15,55.88
  Bottom 0.813: Q5.3 36.83,48.9 | 36.83,48.9 40.32,48.9 41.91,46.99 44.45,46.99 49.53,49.53 v53.34,52.07 Q1.3 | 71.12,49.53 69.85,49.53 66.04,50.8 v63.5,52.07 61.91,54.61 59.69,56.52 v57.15,55.88 | Q7.3 71.12,49.53 | 71.12,49.53 74.93,52.07 80.01,55.88 83.82,57.15 92.71,57.15 R18.2 99.06,54.61 100.01,52.07 100.01,49.53 D4.C 93.98,49.53 Q16.1 | v57.15,66.04 Q3.3 58.74,62.55 Q33.1 | A.S2 8.89,48.26 13.97,48.26 20.64,51.44 32.7,51.44 36.83,48.9
N$51
  Bottom 0.813: Q5.1 Q6.3
N$52
  Bottom 0.813: Q4.3 46.99,67.31 Q3.1
N$53
  Bottom 0.813: Q12.1 Q13.3
N$54
  Bottom 0.813: Q13.1 84.46,102.55 84.46,105.73 Q14.3
N$55
  Bottom 0.813: C27.1 R45.1 13.97,33.02 8.89,33.02 A.L2
N$56
  Bottom 0.813: C27.2 R45.2 34.29,29.21 36.83,30.48 Q31.2
N$57
  Bottom 0.813: C28.1 R46.1 15.24,29.21 8.89,29.21 A.K2
N$58
  Bottom 0.813: C28.2 R46.2 33.02,26.67 38.1,29.21 42.55,29.84 44.45,31.75 Q32.2
N$59
  Bottom 0.813: Q22.2 C20.2 R34.2
N$60
  Bottom 0.813: Q31.1 Q32.3
N$61
  Bottom 0.813: C26.1 R43.1 17.78,20.32 15.24,22.86 8.89,22.86 A.H2
N$62
  Bottom 0.813: C26.2 R43.2 33.02,15.24 35.56,21.59 38.1,25.4 40.64,26.67 46.99,27.94 53.34,27.94 57.15,29.21 60.96,29.21 62.23,30.48 Q27.2
N$63
  Bottom 0.813: C23.2 R40.2 35.56,76.2 37.47,78.74 40.64,78.74 45.09,81.6 48.9,81.6 52.07,78.74 52.07,76.2 50.8,74.93 Q29.2
N$64
  Bottom 0.813: Q26.1 Q27.3
N$65
  Bottom 0.813: C25.1 R42.1 13.97,26.67 8.89,26.67 A.J2
N$66
  Bottom 0.813: B.K2 8.89,99.06 15.24,99.06 17.78,96.52 21.27,90.49 21.91,87.95 22.23,84.45 R41.1 C24.1
N$67
  Bottom 0.813: C24.2 R41.2 41.91,81.28 45.4,83.19 49.21,83.19 Q30.2
N$68
  Bottom 0.813: C21.1 R35.1 21.59,64.77 19.05,69.85 16.51,80.01 15.24,82.55 13.97,83.82 8.89,83.82 B.D2
N$69
  Bottom 0.813: Q29.1 Q30.3
N$70
  Bottom 0.813: B.J2 8.89,96.52 13.97,96.52 17.78,93.98 20.32,88.9 20.96,84.14 22.54,78.11 23.5,76.2 R40.1 C23.1
N$71
  Bottom 0.813: R35.2 C21.2 29.53,63.5 29.85,83.82 29.85,84.45 30.8,86.04 32.7,87.31 34.29,87.63 36.83,86.36 38.1,85.09 Q23.2
N$72
  Bottom 0.813: Q23.3 44.45,91.44 45.72,93.98 49.53,96.52 Q22.1
N$73
  Bottom 0.813: D20.A D21.C
N$74
  Bottom 0.813: D19.A 87.63,77.47 D20.C
N$75
  Bottom 0.813: D16.A D17.C
N$76
  Bottom 0.813: D17.A D18.C
N$77
  Bottom 0.813: D13.C Q18.3 R51.2
N$78
  Bottom 0.813: R11.2 D3.A
N$79
  Bottom 0.813: Q9.2 C13.1 R12.1 R11.1
N$80
  Bottom 0.813: Q24.2 C18.1 R31.1 77.79,13.02 R30.2
N$81
  Bottom 0.813: D12.A R30.1
N$82
  Bottom 0.813: Q8.2 62.23,12.7 73.66,12.7 79.38,10.79 80.96,10.79 82.87,13.02 R10.2 Q9.1
N$83
  Bottom 0.813: Q25.2 43.18,10.79 47.63,13.34 50.8,15.88 60.33,19.37 63.18,20 65.72,20 R32.2 Q24.1
N$84
  Bottom 0.813: R38.2 38.1,20.32 34.29,13.97 30.16,9.84 21.91,9.84 19.05,13.97 15.24,19.05 13.97,20.32 8.89,20.32 A.F2
N$85
  Bottom 0.813: A.U2 8.89,54.61 33.02,54.61 39.69,52.07 Q35.2 53.34,57.15 57.15,58.1 60.96,58.1 64.14,54.29 68.26,51.44 71.12,53.02 73.66,54.61 74.93,59.69 74.93,64.77 73.98,67.31 74.93,69.85 D27.C 82.55,69.85 R48.2
OUT_0\  (via drill 0.81)
  Top 0.813: v52.07,24.13 v52.07,13.97
  Bottom 0.813: A.E2 10.16,16.51 14.61,16.51 16.19,14.61 19.05,10.16 20.64,8.89 21.91,8.26 30.48,8.26 31.75,8.89 40.64,17.78 41.52,18.37 | 41.52,18.37 44.45,20.32 v52.07,24.13 R20.1 | v52.07,13.97 Q8.3 D1.C R3.2 R9.2 | R49.2 41.52,18.37
OUT_1
  Bottom 0.813: A.D2 8.89,13.97 13.97,13.97 15.24,12.7 17.78,8.89 20.96,6.67 31.75,6.67 | 31.75,6.67 32.39,6.67 Q25.3 R38.1 D14.C R36.2 R37.2 R25.2 | R52.2 31.75,6.67

### Text on the board
Bottom: 4-65 | PDP-7 ACCUMULATOR | B210 B